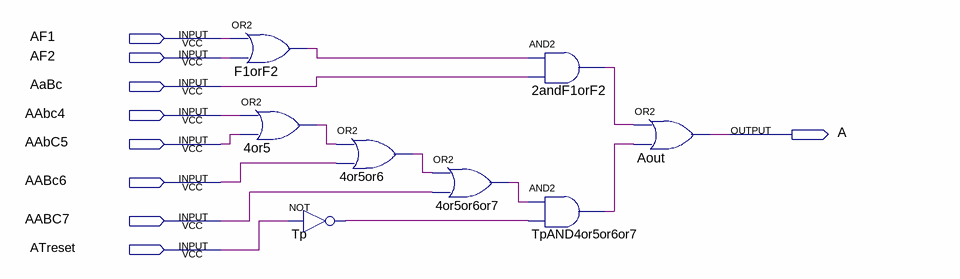
[diagram p0: schematic sheet]
// Quartus schematic A.bdf as structural Verilog: 8 symbols, 9 pins
module A (
  input  AF1,
  input  AF2,
  input  AaBc,
  input  AAbc4,
  input  AAbC5,
  input  AABc6,
  input  AABC7,
  input  ATreset,
  output A
);

  wire F1orF2_out, n2andF1orF2_out, n4or5_out, n4or5or6_out, n4or5or6or7_out, Tp_out, TpAND4or5or6or7_out;

  or F1orF2 (F1orF2_out, AF1, AF2);
  or u_4or5 (n4or5_out, AAbc4, AAbC5);
  or u_4or5or6 (n4or5or6_out, n4or5_out, AABc6);
  not Tp (Tp_out, ATreset);
  or u_4or5or6or7 (n4or5or6or7_out, n4or5or6_out, AABC7);
  and u_2andF1orF2 (n2andF1orF2_out, F1orF2_out, AaBc);
  and TpAND4or5or6or7 (TpAND4or5or6or7_out, n4or5or6or7_out, Tp_out);
  or Aout (A, n2andF1orF2_out, TpAND4or5or6or7_out);
endmodule
